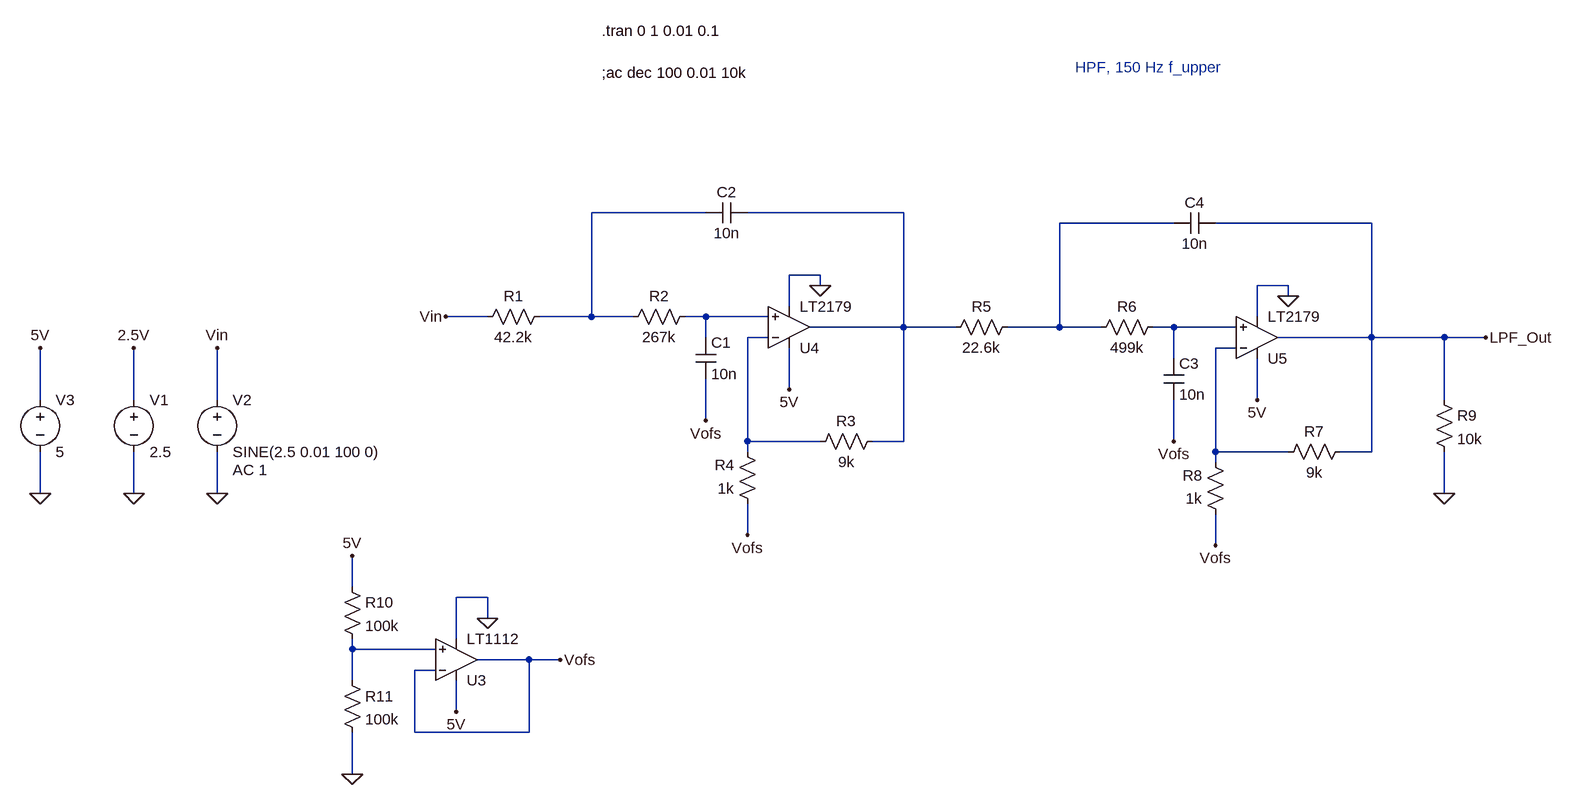
[diagram p0: schematic LPF.asc]
LPF.asc, the LTspice schematic file:
Version 4
SHEET 1 1672 836
WIRE 352 -48 176 -48
WIRE 656 -48 416 -48
WIRE 1072 -32 896 -32
WIRE 1376 -32 1136 -32
WIRE 528 48 480 48
WIRE 528 64 528 48
WIRE 1248 64 1200 64
WIRE 1248 80 1248 64
WIRE 480 96 480 48
WIRE 16 112 -48 112
WIRE 176 112 176 -48
WIRE 176 112 96 112
WIRE 240 112 176 112
WIRE 352 112 320 112
WIRE 448 112 352 112
WIRE 1200 112 1200 64
WIRE 656 128 656 -48
WIRE 656 128 512 128
WIRE 736 128 656 128
WIRE 896 128 896 -32
WIRE 896 128 816 128
WIRE 960 128 896 128
WIRE 1072 128 1040 128
WIRE 1168 128 1072 128
WIRE 352 144 352 112
WIRE 448 144 416 144
WIRE 1376 144 1376 -32
WIRE 1376 144 1232 144
WIRE 1488 144 1376 144
WIRE 1552 144 1488 144
WIRE 1168 160 1136 160
WIRE 1072 176 1072 128
WIRE 480 224 480 160
WIRE -672 240 -672 160
WIRE -528 240 -528 160
WIRE -400 240 -400 160
WIRE 1200 240 1200 176
WIRE 1488 240 1488 144
WIRE 352 272 352 208
WIRE 416 304 416 144
WIRE 528 304 416 304
WIRE 656 304 656 128
WIRE 656 304 608 304
WIRE 1072 304 1072 240
WIRE 416 320 416 304
WIRE 1136 320 1136 160
WIRE 1248 320 1136 320
WIRE 1376 320 1376 144
WIRE 1376 320 1328 320
WIRE 1136 336 1136 320
WIRE -672 384 -672 320
WIRE -528 384 -528 320
WIRE -400 384 -400 320
WIRE 1488 384 1488 320
WIRE 416 448 416 400
WIRE 1136 464 1136 416
WIRE -192 528 -192 480
WIRE 16 544 -32 544
WIRE 16 576 16 544
WIRE -32 608 -32 544
WIRE -192 624 -192 608
WIRE -64 624 -192 624
WIRE 80 640 0 640
WIRE 128 640 80 640
WIRE -64 656 -96 656
WIRE -192 672 -192 624
WIRE -32 720 -32 672
WIRE -96 752 -96 656
WIRE 80 752 80 640
WIRE 80 752 -96 752
WIRE -192 816 -192 752
FLAG 528 64 0
FLAG 480 224 5V
FLAG -48 112 Vin
FLAG 1248 80 0
FLAG 1200 240 5V
FLAG 1552 144 LPF_Out
FLAG -528 384 0
FLAG -528 160 2.5V
FLAG -400 384 0
FLAG -400 160 Vin
FLAG -672 384 0
FLAG -672 160 5V
FLAG 1488 384 0
FLAG -192 480 5V
FLAG -192 816 0
FLAG 128 640 Vofs
FLAG 352 272 Vofs
FLAG 416 448 Vofs
FLAG 1072 304 Vofs
FLAG 1136 464 Vofs
FLAG 16 576 0
FLAG -32 720 5V
SYMBOL res 112 96 R90
WINDOW 0 0 56 VBottom 2
WINDOW 3 32 56 VTop 2
SYMATTR InstName R1
SYMATTR Value 42.2k
SYMBOL res 336 96 R90
WINDOW 0 0 56 VBottom 2
WINDOW 3 32 56 VTop 2
SYMATTR InstName R2
SYMATTR Value 267k
SYMBOL cap 336 144 R0
SYMATTR InstName C1
SYMATTR Value 10n
SYMBOL cap 416 -64 R90
WINDOW 0 0 32 VBottom 2
WINDOW 3 32 32 VTop 2
SYMATTR InstName C2
SYMATTR Value 10n
SYMBOL res 624 288 R90
WINDOW 0 0 56 VBottom 2
WINDOW 3 32 56 VTop 2
SYMATTR InstName R3
SYMATTR Value 9k
SYMBOL res 432 416 R180
WINDOW 0 36 76 Left 2
WINDOW 3 36 40 Left 2
SYMATTR InstName R4
SYMATTR Value 1k
SYMBOL res 832 112 R90
WINDOW 0 0 56 VBottom 2
WINDOW 3 32 56 VTop 2
SYMATTR InstName R5
SYMATTR Value 22.6k
SYMBOL res 1056 112 R90
WINDOW 0 0 56 VBottom 2
WINDOW 3 32 56 VTop 2
SYMATTR InstName R6
SYMATTR Value 499k
SYMBOL cap 1056 176 R0
SYMATTR InstName C3
SYMATTR Value 10n
SYMBOL cap 1136 -48 R90
WINDOW 0 0 32 VBottom 2
WINDOW 3 32 32 VTop 2
SYMATTR InstName C4
SYMATTR Value 10n
SYMBOL res 1344 304 R90
WINDOW 0 0 56 VBottom 2
WINDOW 3 32 56 VTop 2
SYMATTR InstName R7
SYMATTR Value 9k
SYMBOL res 1152 432 R180
WINDOW 0 36 76 Left 2
WINDOW 3 36 40 Left 2
SYMATTR InstName R8
SYMATTR Value 1k
SYMBOL voltage -528 224 R0
WINDOW 123 0 0 Left 0
WINDOW 39 0 0 Left 0
SYMATTR InstName V1
SYMATTR Value 2.5
SYMBOL voltage -400 224 R0
WINDOW 123 24 124 Left 2
WINDOW 39 0 0 Left 0
SYMATTR InstName V2
SYMATTR Value SINE(2.5 0.01 100 0)
SYMATTR Value2 AC 1
SYMBOL voltage -672 224 R0
WINDOW 123 0 0 Left 0
WINDOW 39 0 0 Left 0
SYMATTR InstName V3
SYMATTR Value 5
SYMBOL res 1472 224 R0
SYMATTR InstName R9
SYMATTR Value 10k
SYMBOL OpAmps\\LT1112 -32 704 M180
SYMATTR InstName U3
SYMBOL res -208 512 R0
SYMATTR InstName R10
SYMATTR Value 100k
SYMBOL res -208 656 R0
SYMATTR InstName R11
SYMATTR Value 100k
SYMBOL OpAmps\\LT2179 480 192 M180
SYMATTR InstName U4
SYMBOL OpAmps\\LT2179 1200 208 M180
SYMATTR InstName U5
TEXT 920 -272 Left 2 ;HPF, 150 Hz f_upper
TEXT 192 -264 Left 2 !;ac dec 100 0.01 10k
TEXT 192 -328 Left 2 !.tran 0 1 0.01 0.1

The netlist it stands for:
* LPF.asc
R1 N001 Vin 42.2k
R2 N004 N001 267k
C1 N004 Vofs 10n
C2 N002 N001 10n
R3 N002 N006 9k
R4 Vofs N006 1k
R5 N003 N002 22.6k
R6 N005 N003 499k
C3 N005 Vofs 10n
C4 LPF_Out N003 10n
R7 LPF_Out N007 9k
R8 Vofs N007 1k
V1 2.5V 0 2.5
V2 Vin 0 SINE(2.5 0.01 100 0) AC 1
V3 5V 0 5
R9 LPF_Out 0 10k
XU3 N008 Vofs 5V 0 Vofs LT1112  ; pins In+ In- V+ V- OUT
R10 5V N008 100k
R11 N008 0 100k
XU4 N004 N006 5V 0 N002 LT2179  ; pins In+ In- V+ V- OUT
XU5 N005 N007 5V 0 LPF_Out LT2179  ; pins In+ In- V+ V- OUT
* HPF, 150 Hz f_upper
;ac dec 100 0.01 10k
.tran 0 1 0.01 0.1
.lib LTC.lib
.backanno
.end